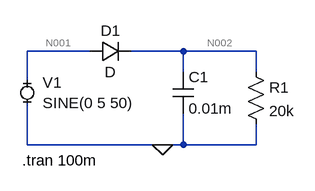
[diagram p0: schematic 1 shema.asc]
1 shema.asc, the LTspice schematic file:
Version 4
SHEET 1 880 680
WIRE 208 128 112 128
WIRE 352 128 272 128
WIRE 464 128 352 128
WIRE 352 160 352 128
WIRE 464 160 464 128
WIRE 112 176 112 128
WIRE 112 272 112 208
WIRE 320 272 112 272
WIRE 352 272 352 224
WIRE 352 272 320 272
WIRE 464 272 464 240
WIRE 464 272 352 272
FLAG 320 272 0
SYMBOL MiniSyms4\\voltage- 112 192 R0
WINDOW 123 0 0 Left 2
WINDOW 39 0 0 Left 2
SYMATTR InstName V1
SYMATTR Value SINE(0 5 50)
SYMBOL diode 208 144 R270
WINDOW 0 32 32 VTop 2
WINDOW 3 0 32 VBottom 2
SYMATTR InstName D1
SYMBOL cap 336 160 R0
SYMATTR InstName C1
SYMATTR Value 0.01m
SYMBOL res 448 144 R0
SYMATTR InstName R1
SYMATTR Value 20k
TEXT 104 296 Left 2 !.tran 100m

The netlist it stands for:
* 1 shema.asc
V1 N001 0 SINE(0 5 50)
D1 N001 N002 D
C1 N002 0 0.01m
R1 N002 0 20k
.model D D
.lib standard.dio
.tran 100m
.backanno
.end

* Results of the author's LTspice run, read from the files saved beside the schematic
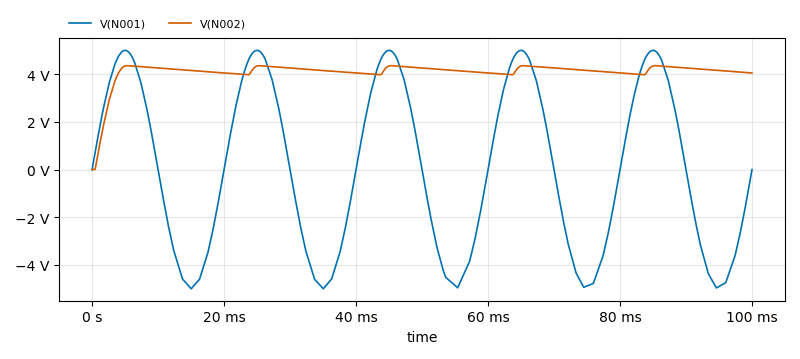
[diagram p1: Transient Analysis of 1 shema.asc, plotted from the saved traces]
* Transient Analysis, 1 run:
*   V(N001): min -4.999 V, max 4.999 V, average 14.94 mV, rms 3.521 V, last 0 V
*   V(N002): min 0 V, max 4.356 V, average 4.091 V, rms 4.122 V, last 4.051 V